# Altium schematic sheet K210_Main.SchDoc
size A2; SheetNumber: 1; SheetTotal: 1; SPICEModelCacheOLSKEWAV: <root> / <DocumentId>OLSKEWAV</DocumentId> / </root>
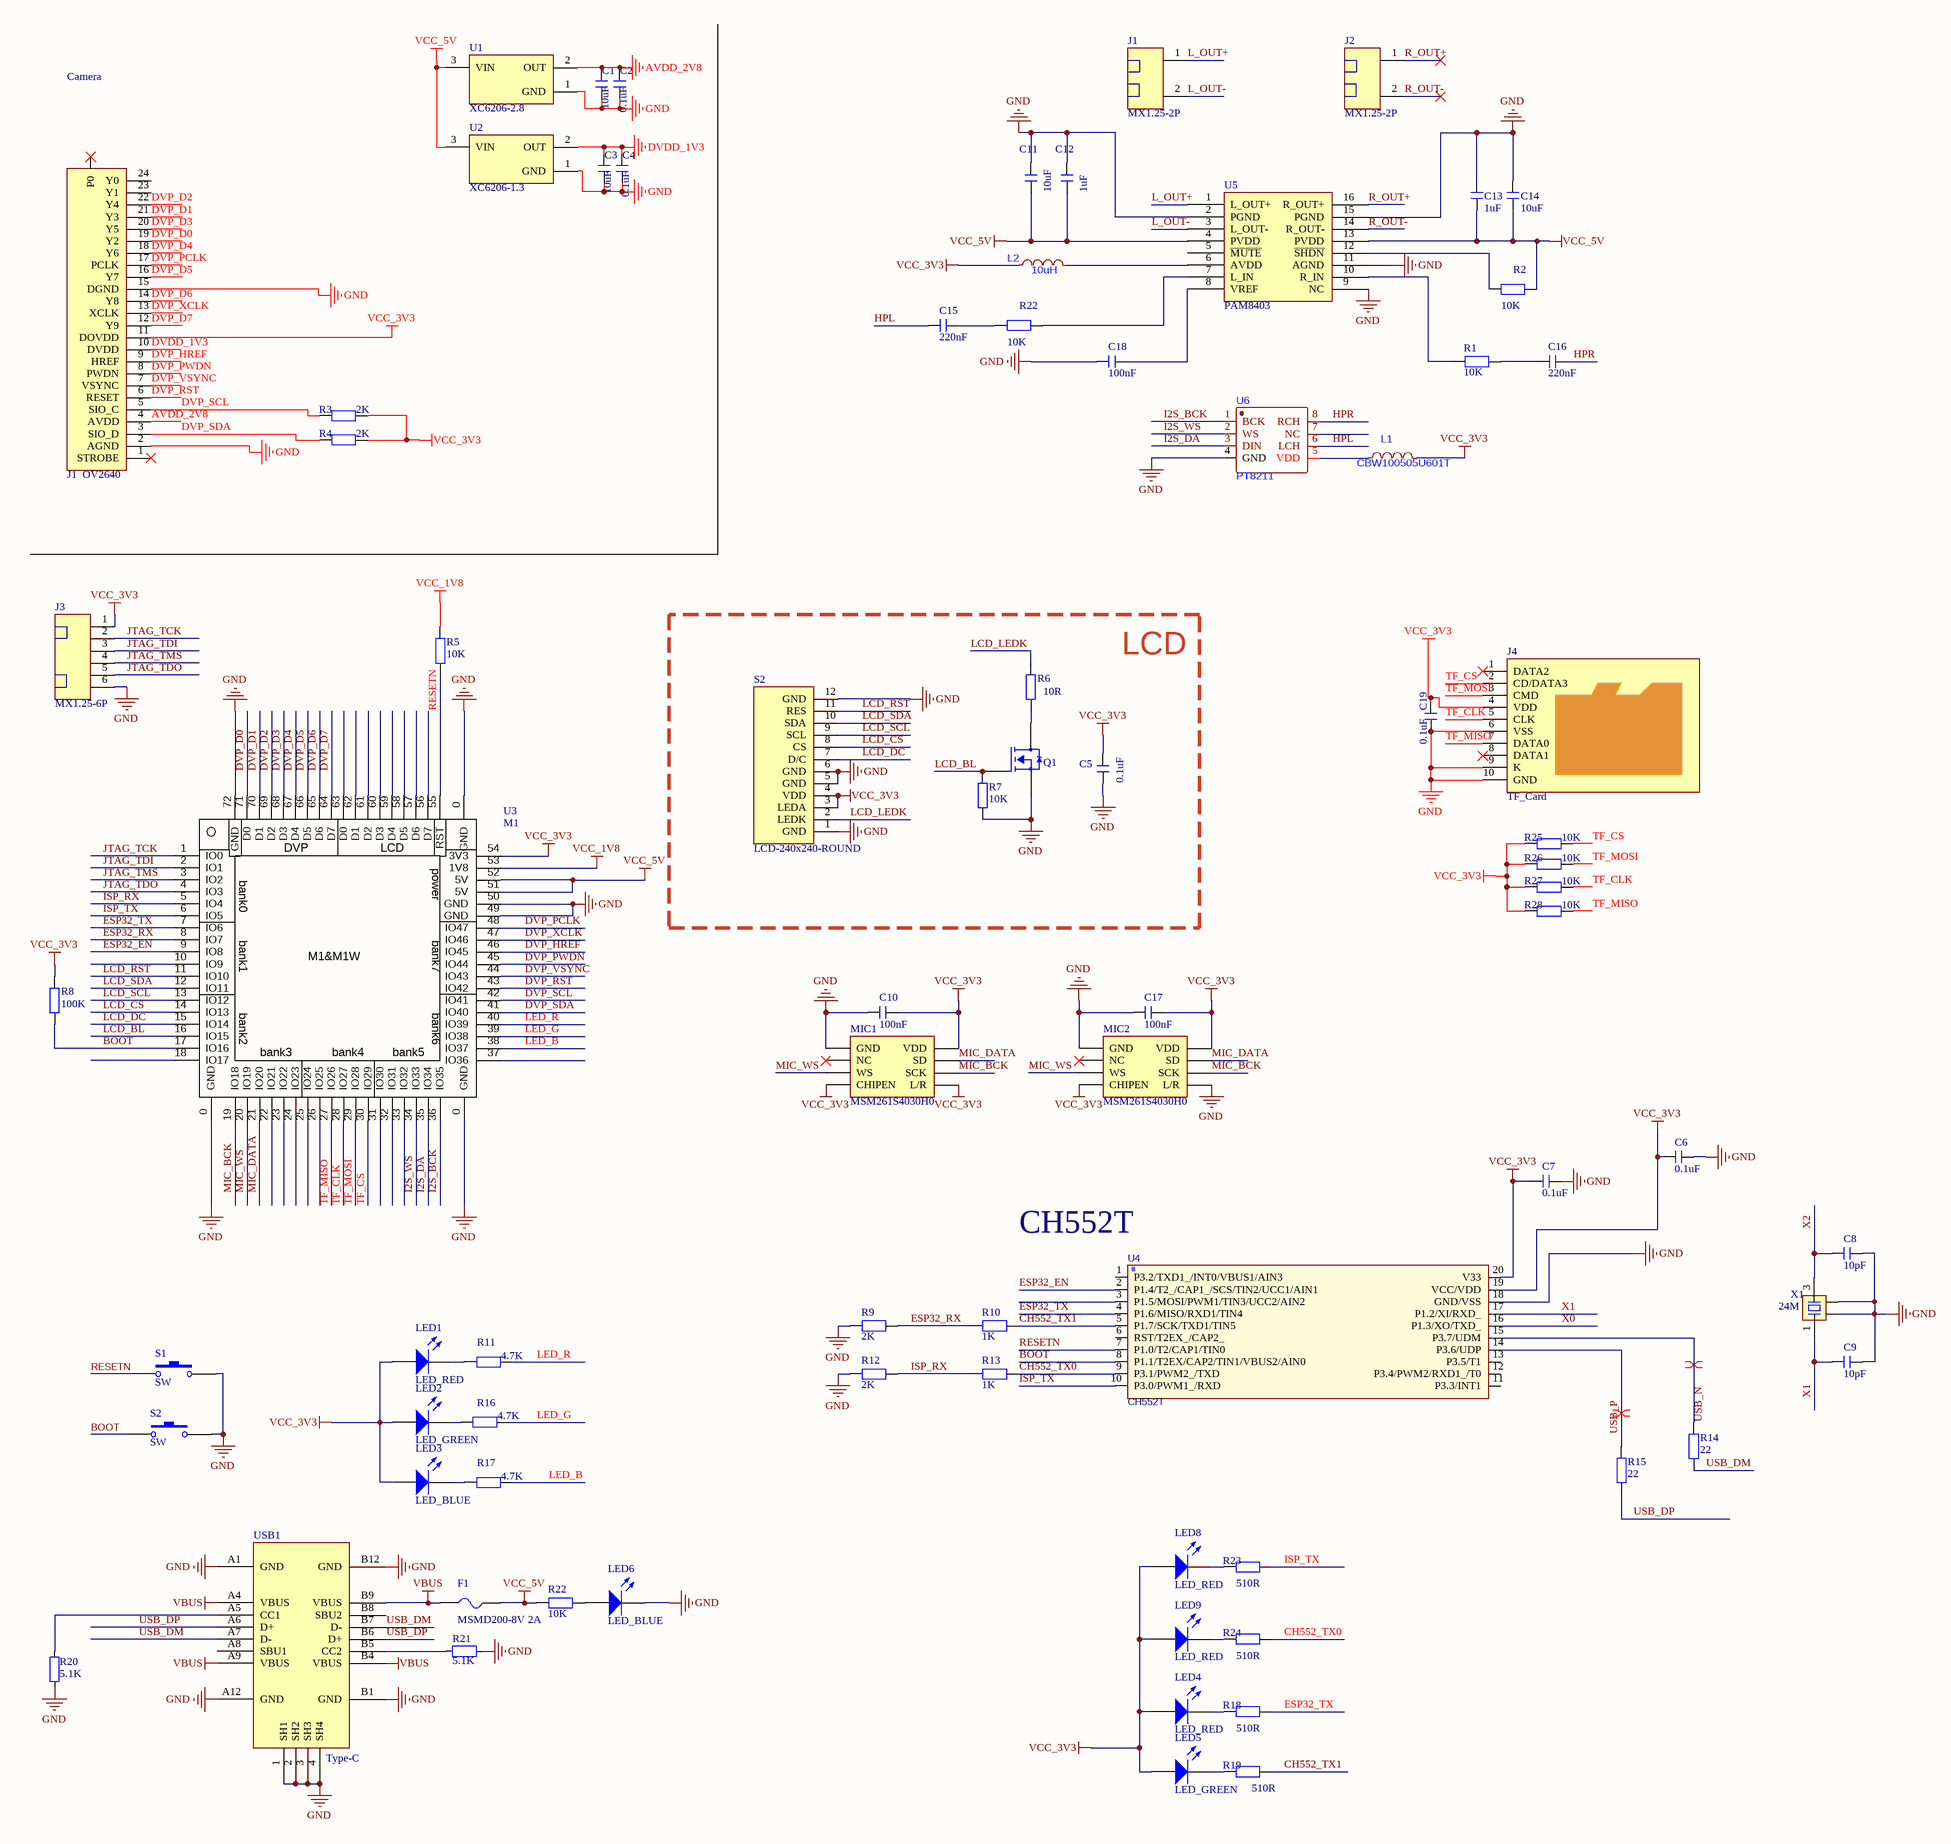
[diagram p0: K210_Main.SchDoc]

## Parts
(Parts that share a designator on the sheet are numbered #1, #2 ... from top to bottom, then left to right.)
C1  10uF  [C 0402_M]
C2  0.1uF  [C 0402_M]
C3  10uF  [C 0402_M]
C4  0.1uF  [C 0402_M]
C5  0.1uF  [C 0402_M]
C6  0.1uF  [C 0402_M]
C7  0.1uF  [C 0402_M]
C8  10pF  [C 0402_M]
C9  10pF  [C 0402_M]
C10  100nF  [C 0402_M]
C11  10uF  [C 0402_M]
C12  1uF  [C 0402_M]
C13  1uF  [C 0402_M]
C14  10uF  [C 0402_M]
C15  220nF  [C 0402_M]
C16  220nF  [C 0402_M]
C17  100nF  [C 0402_M]
C18  100nF  [C 0402_M]
C19  0.1uF  [C 0402_M]
F1  MSMD200-8V 2A  [FU 1210]
J1#1  MX1.25-2P  [MX1.25WS-2P]
J1#2  OV2640  [FFC/SM0.5-2H24-OV5640]
J2  MX1.25-2P  [MX1.25WS-2P]
J3  MX1.25-6P  [MX1.25WS-6P]
J4  TF_Card  [TF-SOCKET - short]
L1  CBW100505U601T  [CBW100505U601T]
L2  10uH  [CBW100505U601T]
LED1  LED_RED  [0603+]
LED2  LED_GREEN  [0603+]
LED3  LED_BLUE  [0603+]
LED4  LED_RED  [0603+]
LED5  LED_GREEN  [0603+]
LED6  LED_BLUE  [0603+]
LED8  LED_RED  [0603+]
LED9  LED_RED  [0603+]
MIC1  MSM261S4030H0  [MSM261S4030H0]
MIC2  MSM261S4030H0  [MSM261S4030H0]
Q1  AO3400A  [SOT23-3]  (value not drawn)
R1  10K  [R 0402_M]
R2  10K  [R 0402_M]
R3  2K  [R 0402_M]
R4  2K  [R 0402_M]
R5  10K  [R 0402_M]
R6  10R  [R 0402_M]
R7  10K  [R 0402_M]
R8  100K  [R 0402_M]
R9  2K  [R 0402_M]
R10  1K  [R 0402_M]
R11  4.7K  [R 0402_M]
R12  2K  [R 0402_M]
R13  1K  [R 0402_M]
R14  22  [R 0402_M]
R15  22  [R 0402_M]
R16  4.7K  [R 0402_M]
R17  4.7K  [R 0402_M]
R18  510R  [R 0402_M]
R19  510R  [R 0402_M]
R20  5.1K  [RES_0402]
R21  5.1K  [RES_0402]
R22#1  10K  [R 0402_M]
R22#2  10K  [R 0402_M]
R23  510R  [R 0402_M]
R24  510R  [R 0402_M]
R25  10K  [R 0402_M]
R26  10K  [R 0402_M]
R27  10K  [R 0402_M]
R28  10K  [R 0402_M]
S1  SW  [KEY_1]
S2#1  LCD-240x240-ROUND  [PCBComponent_1]
S2#2  SW  [KEY_1]
U1  XC6206-2.8  [SOT23-3N]
U2  XC6206-1.3  [SOT23-3N]
U3  M1  [M1W]
U4  CH552T  [TSSOP-20_L6.5-W4.4-P0.65-LS6.4-BL]
U5  PAM8403  [LC-SOP-16_208mil]
U6  PT8211  [SOP-8]
USB1  Type-C  [Type-C-TOP]
X1  24M  [OSC 3225-4P]

## Blocks framed on the sheet
LCD: C5 Q1 R6 R7 S2#1

## Nets
AVDD_2V8: C1.2 C2.2 J1#2.4(AVDD) U1.2(OUT)
DVDD_1V3: C3.2 C4.2 J1#2.10(DVDD) U2.2(OUT)
GND: C1.1 C2.1 C3.1 C4.1 C5.1 C6.1 C7.1 C8.1 C9.1 C10.2 C11.2 C12.2 C13.1 C14.1 C17.2 C18.2 C19.2 J1#2.2(AGND) J1#2.15(DGND) J3.6 J4.6(VSS) J4.9(K) J4.10(GND) LED6.2(K) MIC1.1(GND) MIC2.1(GND) MIC2.5(L/R) Q1.2(S) R7.2 R9.2 R12.2 R20.2 R21.1 S1.2 S2#1.1(GND) S2#1.5(GND) S2#1.6(GND) S2#1.12(GND) S2#2.2 U1.1(GND) U2.1(GND) U3.0(GND) U3.49(GND) U3.50(GND) U3.72(GND) U4.18(GND/VSS) U5.2(PGND) U5.9(NC) U5.11(AGND) U5.15(PGND) U6.4(GND) USB1.1(SH1) USB1.2(SH2) USB1.3(SH3) USB1.4(SH4) USB1.A1(GND) USB1.A12(GND) USB1.B1(GND) USB1.B12(GND) X1.2 X1.4
VBUS: F1.1 USB1.A4(VBUS) USB1.A9(VBUS) USB1.B4(VBUS) USB1.B9(VBUS)
VCC_1V8: R5.2 U3.53(1V8)
VCC_3V3: C5.2 C6.2 C7.2 C10.1 C17.1 C19.1 J1#2.11(DOVDD) J3.1 J4.4(VDD) L1.2 L2.1 LED1.1(A) LED2.1(A) LED3.1(A) LED4.1(A) LED5.1(A) LED8.1(A) LED9.1(A) MIC1.4(CHIPEN) MIC1.5(L/R) MIC1.8(VDD) MIC2.4(CHIPEN) MIC2.8(VDD) R3.2 R4.2 R8.2 R25.1 R26.1 R27.1 R28.1 S2#1.3(LEDA) S2#1.4(VDD) U3.54(3V3) U4.19(VCC/VDD) U4.20(V33)
VCC_5V: C11.1 C12.1 C13.2 C14.2 F1.2 R2.2 R22#2.2 U1.3(VIN) U2.3(VIN) U3.51(5V) U3.52(5V) U5.4(PVDD) U5.13(PVDD)
BOOT: R8.1 S2#2.1 U3.17(IO16) U4.8(P1.1/T2EX/CAP2/TIN1/VBUS2/AIN0)
CH552_TX0: R13.1 R24.2 U4.9(P3.1/PWM2_/TXD)
CH552_TX1: R10.1 R19.2 U4.5(P1.7/SCK/TXD1/TIN5)
DVP_D0: J1#2.19(Y2) U3.71(D0)
DVP_D1: J1#2.21(Y3) U3.70(D1)
DVP_D2: J1#2.22(Y4) U3.69(D2)
DVP_D3: J1#2.20(Y5) U3.68(D3)
DVP_D4: J1#2.18(Y6) U3.67(D4)
DVP_D5: J1#2.16(Y7) U3.66(D5)
DVP_D6: J1#2.14(Y8) U3.65(D6)
DVP_D7: J1#2.12(Y9) U3.64(D7)
DVP_HREF: J1#2.9(HREF) U3.46(IO45)
DVP_PCLK: J1#2.17(PCLK) U3.48(IO47)
DVP_PWDN: J1#2.8(PWDN) U3.45(IO44)
DVP_RST: J1#2.6(RESET) U3.43(IO42)
DVP_SCL: J1#2.5(SIO_C) R3.1 U3.42(IO41)
DVP_SDA: J1#2.3(SIO_D) R4.1 U3.41(IO40)
DVP_VSYNC: J1#2.7(VSYNC) U3.44(IO43)
DVP_XCLK: J1#2.13(XCLK) U3.47(IO46)
ESP32_EN: U3.9(IO8) U4.2(P1.4/T2_/CAP1_/SCS/TIN2/UCC1/AIN1)
ESP32_RX: R9.1 R10.2 U3.8(IO7)
ESP32_TX: R18.2 U3.7(IO6) U4.4(P1.6/MISO/RXD1/TIN4)
HPL: C15.2 U6.6(LCH)
HPR: C16.2 U6.8(RCH)
I2S_BCK: U3.36(IO35) U6.1(BCK)
I2S_DA: U3.35(IO34) U6.3(DIN)
I2S_WS: U3.34(IO33) U6.2(WS)
ISP_RX: R12.1 R13.2 U3.5(IO4)
ISP_TX: R23.2 U3.6(IO5) U4.10(P3.0/PWM1_/RXD)
JTAG_TCK: J3.2 U3.1(IO0)
JTAG_TDI: J3.3 U3.2(IO1)
JTAG_TDO: J3.5 U3.4(IO3)
JTAG_TMS: J3.4 U3.3(IO2)
L_OUT+: J1#1.1 U5.1(L_OUT+)
L_OUT-: J1#1.2 U5.3(L_OUT-)
LCD_BL: Q1.1(G) R7.1 U3.16(IO15)
LCD_CS: S2#1.8(CS) U3.14(IO13)
LCD_DC: S2#1.7(D/C) U3.15(IO14)
LCD_LEDK: R6.1 S2#1.2(LEDK)
LCD_RST: S2#1.11(RES) U3.11(IO10)
LCD_SCL: S2#1.9(SCL) U3.13(IO12)
LCD_SDA: S2#1.10(SDA) U3.12(IO11)
LED_B: R17.2 U3.38(IO37)
LED_G: R16.2 U3.39(IO38)
LED_R: R11.2 U3.40(IO39)
MIC_BCK: MIC1.6(SCK) MIC2.6(SCK) U3.19(IO18)
MIC_DATA: MIC1.7(SD) MIC2.7(SD) U3.21(IO20)
MIC_WS: MIC1.3(WS) MIC2.3(WS) U3.20(IO19)
R_OUT+: J2.1 U5.16(R_OUT+)
R_OUT-: J2.2 U5.14(R_OUT-)
RESETN: R5.1 S1.1 U3.55(RST) U4.7(P1.0/T2/CAP1/TIN0)
TF_CLK: J4.5(CLK) R27.2 U3.28(IO27)
TF_CS: J4.2(CD/DATA3) R25.2 U3.30(IO29)
TF_MISO: J4.7(DATA0) R28.2 U3.27(IO26)
TF_MOSI: J4.3(CMD) R26.2 U3.29(IO28)
USB_DM: R14.2 USB1.A7(D-) USB1.B7(D-)
USB_DP: R15.2 USB1.A6(D+) USB1.B6(D+)
USB_P: R15.1 U4.14(P3.6/UDP)
X0: U4.16(P1.3/XO/TXD_)
X1: C9.2 U4.17(P1.2/XI/RXD_) X1.1
X2: C8.2 X1.3
NetC15_1: C15.1 R22#1.1
NetC16_1: C16.1 R1.1
NetC18_1: C18.1 U5.8(VREF)
NetL1_1: L1.1 U6.5(VDD)
NetL2_2: L2.2 U5.6(AVDD)
NetLED1_2: LED1.2(K) R11.1
NetLED2_2: LED2.2(K) R16.1
NetLED3_2: LED3.2(K) R17.1
NetLED4_2: LED4.2(K) R18.1
NetLED5_2: LED5.2(K) R19.1
NetLED6_1: LED6.1(A) R22#2.1
NetLED8_2: LED8.2(K) R23.1
NetLED9_2: LED9.2(K) R24.1
NetQ1_3: Q1.3(D) R6.2
NetR1_2: R1.2 U5.10(R_IN)
NetR2_1: R2.1 U5.12(~{SHDN})
NetR14_1: R14.1 U4.15(P3.7/UDM)
NetR20_1: R20.1 USB1.A5(CC1)
NetR21_2: R21.2 USB1.B5(CC2)
NetR22#1_2: R22#1.2 U5.7(L_IN)

Not connected (* = marked no-connect by the designer): J1#2 1(STROBE)* 23(Y1) 24(Y0) P0*; J4 1(DATA2)* 8(DATA1)*; MIC1 2(NC)*; MIC2 2(NC)*; U3 10(IO9) 18(IO17) 22(IO21) 23(IO22) 24(IO23) 25(IO24) 26(IO25) 31(IO30) 32(IO31) 33(IO32) 37(IO36) 56(D7) 57(D6) 58(D5) 59(D4) 60(D3) 61(D2) 62(D1) 63(D0); U4 1(P3.2/TXD1_/INT0/VBUS1/AIN3) 3(P1.5/MOSI/PWM1/TIN3/UCC2/AIN2) 6(RST/T2EX_/CAP2_) 11(P3.3/INT1) 12(P3.4/PWM2/RXD1_/T0) 13(P3.5/T1); U5 5(~{MUTE}); U6 7(NC); USB1 A8(SBU1) B8(SBU2)

## Layout directives
differential pair: NetR14_1, USB_P

## Notes on the sheet
- Camera
- (near U4) CH552T
- Labels drawn without touching a wire or pin: USB_N
- (in symbol M1) DVP; LCD; power; bank0; bank1; bank7; M1&M1W; bank2; bank6; bank3; bank4; bank5

## Library data of the parts
C1-C19 = C: 贴片电容
F1 = FU: 贴片保险丝
J1#2 = OV5640: Header, 24-Pin; LatestRevisionDate: 17-Jul-2002; LatestRevisionNote: Re-released for DXP Platform.; Publisher: Altium Limited
J4 = TF_Card: TF卡座
L2 = CBW100505U601T
LED1-LED6 LED8 LED9 = LED2: Typical RED, GREEN, YELLOW, AMBER GaAs LED
Q1 = AO3400A: N-MOS
R1-R19 R22#1 R22#2 R23-R28 = R: 贴片电阻
R20 R21 = 电阻-0402: Resistor; Value: 22R
S1 S2#2 = SW-PB: Switch; Published: 24-Mar-1999; LatestRevisionDate: 17-Jul-2002; LatestRevisionNote: Re-released for DXP Platform.; PackageReference: SPST-2; Publisher: Altium Limited; PackageDescription: Switch; 2 Leads
S2#1 = LCD-240x240-ROUND: 显示屏
U1 U2 = XC6206-3.3: SOT-23,XC6206P332MR,MAX8V,100mA
U4 = CH552T: BOM_Manufacturer: WCH; BOM_Supplier: LCSC; BOM_Manufacturer Part: CH552T; BOM_Supplier Part: C111367; BOM_JLCPCB Part Class: Extended Part; spicePre: U; spiceSymbolName: CH552T
U6 = TM8211
USB1 = USB-Type-C-TOP
X1 = XTAL-4P: 4脚无源晶振